# Altium schematic sheet Barometer.SchDoc
size A4; SheetNumber: 9; SheetTotal: 13
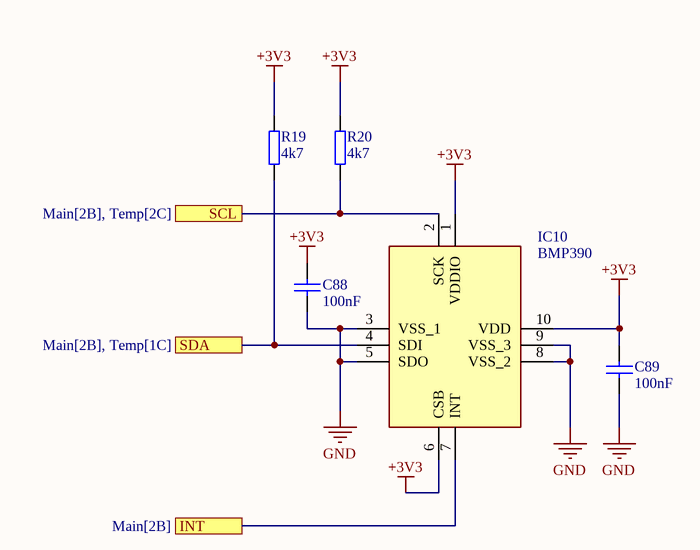
[diagram p0: Barometer.SchDoc]

## Parts
C88  value 100nF  [CAP0402]  (hidden comment: Cap0402)
C89  value 100nF  [CAP0402]  (hidden comment: Cap0402)
IC10  BMP390  [BMP390]
R19  value 4k7  [RES0402]  (hidden comment: Res0402)
R20  value 4k7  [RES0402]  (hidden comment: Res0402)

## Ports
INT (see Main[2B]), SCL (see Main[2B], Temp[2C]), SDA (see Main[2B], Temp[1C])

## Nets
+3V3: C88.2 C89.2 IC10.1(VDDIO) IC10.6(CSB) IC10.10(VDD) R19.2 R20.2
GND: C88.1 C89.1 IC10.3(VSS_1) IC10.5(SDO) IC10.8(VSS_2) IC10.9(VSS_3)
INT: IC10.7(INT) ; port INT
SCL: IC10.2(SCK) R20.1 ; port SCL
SDA: IC10.4(SDI) R19.1 ; port SDA

## Library data of the parts
C88 C89 = Cap0402: Manufacturer_Part_Number: GRM155R71H104ME14D; Voltage: 50V
IC10 = BMP390: Integrated Circuit; Manufacturer_Name: BOSCH; Datasheet Link: https://www.bosch-sensortec.com/media/boschsensortec/downloads/datasheets/bst-bmp390-ds002.pdf; Height: 0.8mm; Manufacturer_Part_Number: BMP390; Mouser Part Number: 262-BMP390; Mouser Price/Stock: https://www.mouser.co.uk/ProductDetail/Bosch-Sensortec/BMP390?qs=QNEnbhJQKvYQVfvRMgo2YA%3D%3D; Arrow Part Number: BMP390; Arrow Price/Stock: https://www.arrow.com/en/products/bmp390/bosch?region=nac
R19 R20 = Res0402: Manufacturer_Part_Number: RC0402JR-7W4K7L